# Altium schematic sheet Trafo.SchDoc: Sheetname
size A4; Date: 05.10.2017; CheckedBy: UNCHECKED; Author: Team Member; Organization: Baltic Racing; Address1: Zur Schwedenschanze 15; Address2: Haus 18; Address3: 18435 Stralsund; Revision: xx.xx; SheetNumber: 7; SheetTotal: 8; Rules: TODO; ProjectName: Projekt
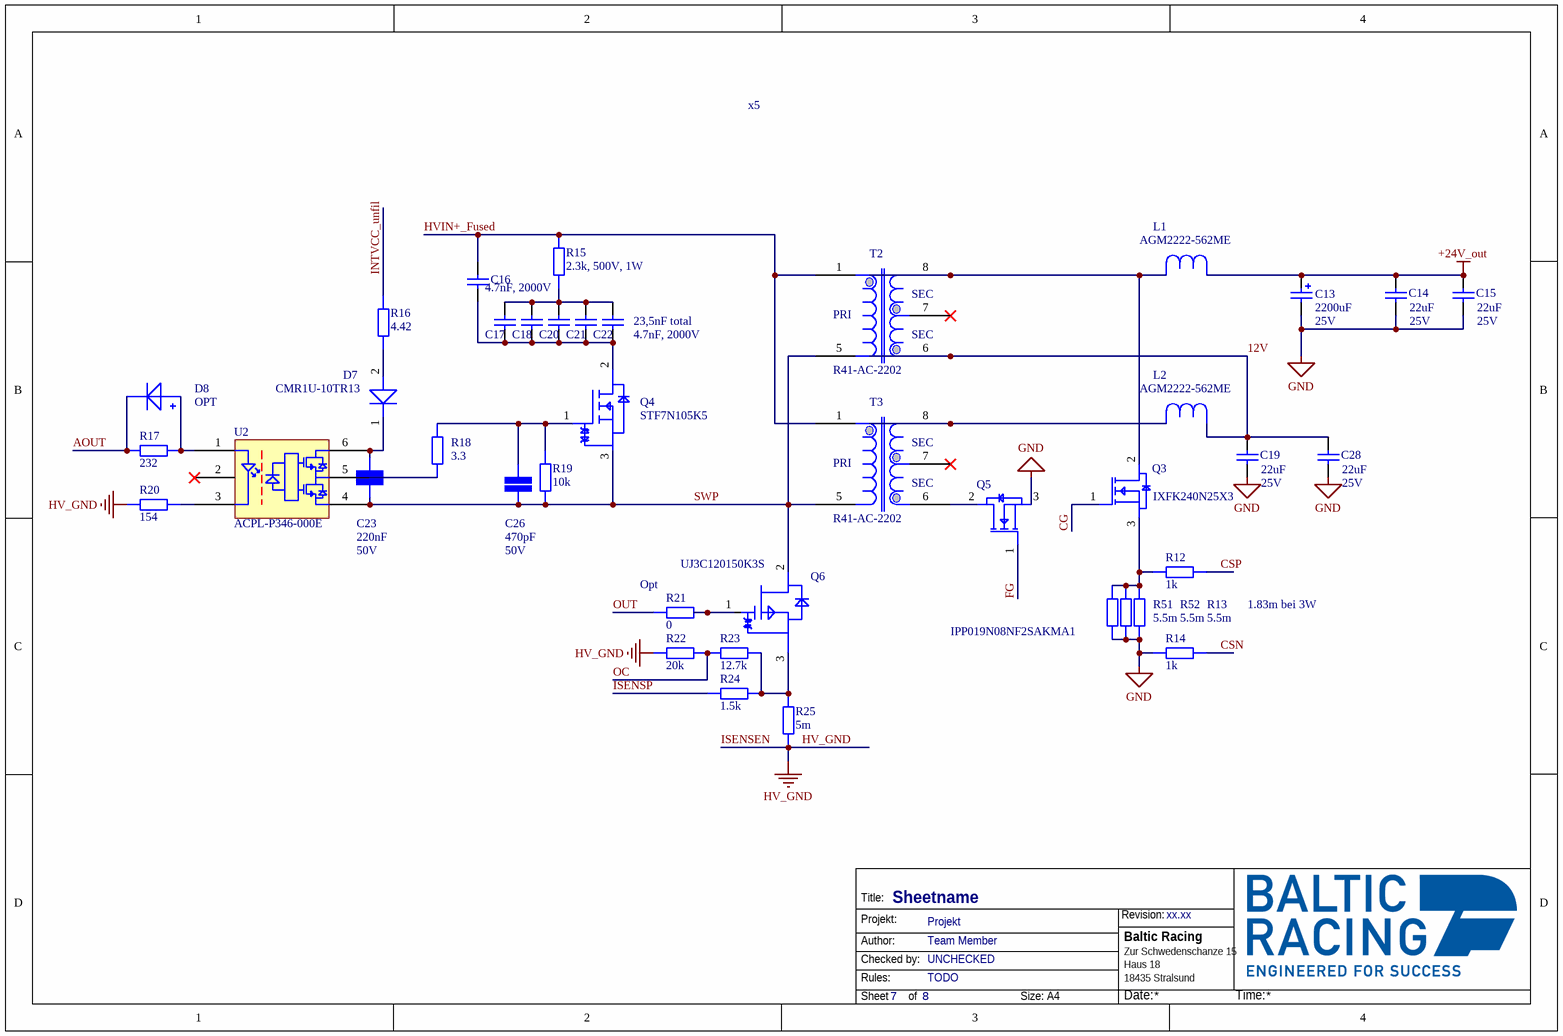
[diagram p0: Trafo.SchDoc]

## Parts
C13  Capacitance: 2200uF  Voltage: 25V  [WCAP-ATG8_D13H25]
C14  Capacitance: 22uF  Voltage: 25V  [WCAP-CSGP_1210_H=2.5mm]
C15  Capacitance: 22uF  Voltage: 25V  [WCAP-CSGP_1210_H=2.5mm]
C16  4.7nF, 2000V  [WCAP-CSMH_1812_H2]
C17  4.7nF, 2000V  [WCAP-CSMH_1812_H2]  (value not drawn)
C18  4.7nF, 2000V  [WCAP-CSMH_1812_H2]  (value not drawn)
C19  Capacitance: 22uF  Voltage: 25V  [WCAP-CSGP_1210_H=2.5mm]
C20  4.7nF, 2000V  [WCAP-CSMH_1812_H2]  (value not drawn)
C21  4.7nF, 2000V  [WCAP-CSMH_1812_H2]  (value not drawn)
C22  4.7nF, 2000V  [WCAP-CSMH_1812_H2]
C23  value 220nF  Voltage: 50V  [CAP 1206/3216]  (hidden comment: SMD Capacitor)
C26  value 470pF  Voltage: 50V  [CAP 1206/3216]  (hidden comment: SMD Capacitor)
C28  Capacitance: 22uF  Voltage: 25V  [WCAP-CSGP_1210_H=2.5mm]
D7  CMR1U-10TR13  [DIOC4536X24L CMR1U-10]
D8  OPT  [DIOM2715X18N]
L1  AGM2222-562ME  [AGM2222-562]
L2  AGM2222-562ME  [AGM2222-562]
Q3  IXFK240N25X3  [IXFK240N25X3_w_Cooler]
Q4  STF7N105K5  [TO-220-3]
Q5  IPP019N08NF2SAKMA1  [IPP019N08NF2SAKMA1_w_Cooler]
Q6  UJ3C120150K3S  [UJ3C120150K3S_w_Cooler]
R12  value 1k  [STACKPOLE CSR1206]  (hidden comment: SMD Resistor)
R13  value 5.5m  [STACKPOLE CSR1206]
R14  value 1k  [STACKPOLE CSR1206]  (hidden comment: SMD Resistor)
R15  value 2.3k, 500V, 1W  [STACKPOLE CSRN2512]  (hidden comment: CRCW25122K20FKEG)
R16  value 4.42  [STACKPOLE CSR0603]  (hidden comment: SMD Resistor)
R17  value 232  [STACKPOLE CSR1206]  (hidden comment: SMD Resistor)
R18  value 3.3  [STACKPOLE CSR0603]  (hidden comment: SMD Resistor)
R19  value 10k  [STACKPOLE CSR0603]  (hidden comment: SMD Resistor)
R20  value 154  [STACKPOLE CSR1206]  (hidden comment: SMD Resistor)
R21  value 0  [STACKPOLE CSR0603]  (hidden comment: SMD Resistor)
R22  value 20k  [STACKPOLE CSR0603]  (hidden comment: SMD Resistor)
R23  value 12.7k  [STACKPOLE CSR0603]  (hidden comment: SMD Resistor)
R24  value 1.5k  [STACKPOLE CSR0603]  (hidden comment: SMD Resistor)
R25  value 5m  [STACKPOLE CSR1206]  (hidden comment: ULR1S-R0055FT2)
R51  value 5.5m  [STACKPOLE CSR1206]
R52  value 5.5m  [STACKPOLE CSR1206]
T2  R41-AC-2202  [R41-AC-2202 Landing Pattern]
T3  R41-AC-2202  [R41-AC-2202 Landing Pattern]
U2  ACPL-P346-000E  [SOP-6 Stretched]

## Nets
+24V_out: C13.1(P) C14.1 C15.1 L1.2
GND: C13.2(N) C14.2 C15.2 C19.2 C28.2 Q5.3 R13.1 R14.1 R51.1 R52.1
HV_GND: R20.1 R22.1 R25.2  [also labelled ISENSEN]
12V: C19.1 C28.1 L2.2 T2.6
AOUT: D8.2 R17.1
CG: Q3.1
CSN: R14.2
CSP: R12.2
FG: Q5.1
HVIN+_Fused: C16.1 R15.2 T2.1 T3.1
INTVCC_unfil: R16.2
ISENSP: R24.1
OC: R22.2 R23.1
OUT: R21.1
SWP: C23.2 C26.2 Q4.3 Q6.2 R19.1 T2.5 T3.5 U2.4
NetC16_2: C16.2 C17.2 C18.2 C20.2 C21.2 C22.2 Q4.2
NetC17_1: C17.1 C18.1 C20.1 C21.1 C22.1 R15.1
NetC23_1: C23.1 D7.1 U2.6
NetC26_1: C26.1 Q4.1 R18.2 R19.2
NetD7_2: D7.2 R16.1
NetD8_1: D8.1 R17.2 U2.1
NetL1_1: L1.1 Q3.2 T2.8
NetL2_1: L2.1 T3.8
NetQ3_3: Q3.3 R12.1 R13.2 R51.2 R52.2
NetQ5_2: Q5.2 T3.6
NetQ6_1: Q6.1 R21.2
NetQ6_3: Q6.3 R23.2 R24.2 R25.1
NetR18_1: R18.1 U2.5
NetR20_2: R20.2 U2.3

Not connected (* = marked no-connect by the designer): T2 7*; T3 7*; U2 2*

## Notes on the sheet
- x5
- (near C22) 23,5nF total
- (near R21) Opt
- 1.83m bei 3W
- Title:
- Projekt:
- Revision:
- Author:
- Rules:
- Checked by:
- Sheet
- of
- Size:
- A4
- Date:
- Time:
- (in symbol R41-AC-2202) SEC; PRI

## Library data of the parts
C13 = 860010478021: WCAP-ATG8 Aluminum Electrolytic Capacitor, Radial, THT, D13xH25, 2200uF, 25V; Manufacturer: Wurth Elektronik; Ripple Current: 1705mA; Rated Voltage: 25VDC; Technical Reference: ATBI250222M025DSPACB000; Leakage Current: 550uA; Endurance: 2000h; Dissipation Factor: 14%; Capacitance Tolerance: +/-20%; ComponentLink2Description: Datasheet; Published Date: October 2020; Packaging: Ammo Pack; Operating Temperature: -40 to +85degC; Mounting Technology: THT; Manufacturer Part Number: 860010478021; Height: 25mm; Diameter: 13mm; ComponentLink2URL: https://www.we-online.com/catalog/datasheet/860010478021.pdf; ComponentLink1URL: http://www.we-online.de; ComponentLink1Description: Manufacturer
C14 C15 C19 C28 = 885012109014: WCAP-CSGP Multilayer Ceramic Chip Capacitor, General Purpose, size 1210, X5R, 22uF, 25V; Manufacturer: Wurth Elektronik; Rated Voltage: 25VDC; Isolation Resistance  min.: 0.005GOhm; Capacitance Tolerance: +/-20%; Dissipation Factor max.: 5%; Technical Reference: X5R1210226M025DFCT10000; ComponentLink1Description: Manufacturer; ComponentLink1URL: http://www.we-online.de; ComponentLink2Description: Datasheet; ComponentLink2URL: https://www.we-online.com/catalog/datasheet/885012109014.pdf; Operating Temperature: -55 to +85degC; Packaging: Tape and Reel; Manufacturer Part Number: 885012109014; Published Date: April 2021; Ceramic Type: X5R; Height: 2.5mm; Mounting Technology: SMT; Size: 1210; Q-Factor min.: -
C16-C18 C20-C22 = 885342211008: WCAP-CSMH Multilayer Ceramic Chip Capacitor, size 1812, X7R Class II, 4.7nF, 2000V; Manufacturer: Wurth Elektronik; Rated Voltage: 2000VDC; Insulation Resistance: 10GOhm; Dissipation Factor: 2.5%; Capacitance Tolerance: +/-10%; Technical Reference: X7R1812472KB00DFCT10000; ComponentLink1Description: Manufacturer; ComponentLink1URL: http://www.we-online.de; ComponentLink2Description: Datasheet; ComponentLink2URL: https://www.we-online.com/catalog/datasheet/885342211008.pdf; Manufacturer Part Number: 885342211008; Mounting Technology: SMT; Operating Temperature: -55 to +125degC; Published Date: May 2020; Packaging: Tape and Reel; Ceramic Type: X7R Class II; Capacitance: 4.7nF; Height: 2mm; Size: 1812
  C16 C17: Voltage: 2000V
C23 C26 = SMD Capacitor: Capacitor with multiple Footprints
D7 = CMR1U-10TR13: Silicon Ultra Fast Recovery Rectifier 1000V 30A 2-Pin SMB Surface Mount T/R; Manufacturer: Central Semiconductor; Average Rectified Current: 1A; Reverse Recovery Time: 100ns; Max Reverse Voltage (DC): 1kV; Forward Voltage: 1.7V; Max Reverse Current: 5uA; Supplier 1: Digi-Key; Manufacturer Part Number: CMR1U-10TR13; RoHS: No; Category: Rectifier Diodes; Pricing 1: 1=1,16000, 10=1,03800, 100=0,80960, 500=0,66880, 1000=0,52800 (USD); Mount: Surface Mount; Case/Package: SMB; Packaging: Tape and Reel; Max Repetitive Reverse Voltage (Vrrm): 1kV; RoHS Compliant: No; Lead Free: Lead Free; ComponentLink1URL: http://www.mouser.com/ds/2/68/cmr1u-01-34700.pdf?src-supplier=Mouser; ComponentLink1Description: http://www.mouser.com/ds/2/68/cmr1u-01-34700.pdf?src-supplier=Mouser; ComponentLink2URL: https://www.centralsemi.com/get_document.php?cmp=1&mergetype=pd&mergepath=pd&pdf_id=CMR1U-01.PDF&src-supplier=Digi-Key; ComponentLink2Description: https://www.centralsemi.com/get_document.php?cmp=1&mergetype=pd&mergepath=pd&pdf_id=CMR1U-01.PDF&src-supplier=Digi-Key; ComponentLink3URL: http://www.centralsemi.com/pdf/CMR1U-01.PDF?src-supplier=Future+Electronics; ComponentLink3Description: http://www.centralsemi.com/pdf/CMR1U-01.PDF?src-supplier=Future+Electronics; ComponentLink4URL: https://my.centralsemi.com/get_document.php?cmp=1&amp;mergetype=pd&amp;mergepath=pd&amp;pdf_id=CMR1U-01.PDF&src-supplier=Digi-Key; ComponentLink4Description: https://my.centralsemi.com/get_document.php?cmp=1&amp;mergetype=pd&amp;mergepath=pd&amp;pdf_id=CMR1U-01.PDF&src-supplier=Digi-Key
D8 = BAT46WH: Supplier 1: Mouser
L1 L2 = AGM2222-562ME: Shielded Power Inductors; ComponentLink1Description: Coilcraft; ComponentLink1URL: https://www.coilcraft.com/en-us/products/power/shielded-inductors/high-current-flat-wire/agp-ver/agm2222/?skuId=30439; ComponentLink2Description: Datasheet; ComponentLink2URL: https://www.coilcraft.com/getmedia/d4f4984d-2507-4e11-ae3d-89829a15fb28/agm2222.pdf
Q3 = IXFK240N25X3: Mosfet N-ch 250V 240A TO264; Manufacturer: IXYS; Supplier 1: Mouser; Manufacturer Part Number: IXFK240N25X3; RoHS: No; Stock 1: 7; Pricing 1: 1=30,00000, 10=27,67000, 50=25,40000, 100=24,04000, 1000=24,04000, 10000=24,04000 (USD)
Q4 = STF7N105K5: N-channel 1050 V, 1.4 Ohm typ., 4 A MDmesh K5 Power MOSFETs in TO-220FP package; Manufacturer: STMicroelectronics; Drain to Source Voltage (Vdss): 1.05kV; Continuous Drain Current (ID): 4A; Rds On Max: 2R; Input Capacitance: 380pF; Max Power Dissipation: 25W; Supplier 1: Newark; Manufacturer Part Number: STF7N105K5; RoHS: Yes; Category: MOSFETs; Stock 1: 996; Pricing 1: 1=3,16000, 10=2,71000, 100=2,16000, 500=1,87000, 1000=1,61000 (USD); Mount: Through Hole; Case/Package: TO-220-3; Min Operating Temperature: -55°C; Max Operating Temperature: 150°C; Packaging: Rail/Tube; Lead Free: Lead Free; RoHS Compliant: Yes; ComponentLink1URL: http://www.mouser.com/ds/2/389/stf7n105k5-955843.pdf?src-supplier=Mouser; ComponentLink1Description: http://www.mouser.com/ds/2/389/stf7n105k5-955843.pdf?src-supplier=Mouser; ComponentLink2URL: http://www.st.com/content/ccc/resource/technical/document/datasheet/26/20/d1/f7/b4/c1/4c/55/DM00112886.pdf/files/DM00112886.pdf/jcr:content/translations/en.DM00112886.pdf?src-supplier=Digi-Key; ComponentLink2Description: http://www.st.com/content/ccc/resource/technical/document/datasheet/26/20/d1/f7/b4/c1/4c/55/DM00112886.pdf/files/DM00112886.pdf/jcr:content/translations/en.DM00112886.pdf?src-supplier=Digi-Key; ComponentLink3URL: http://www.st.com/st-web-ui/static/active/en/resource/technical/document/datasheet/DM00112886.pdf?src-supplier=Avnet; ComponentLink3Description: http://www.st.com/st-web-ui/static/active/en/resource/technical/document/datasheet/DM00112886.pdf?src-supplier=Avnet; ComponentLink4URL: http://www.farnell.com/datasheets/2371890.pdf?src-supplier=Newark; ComponentLink4Description: http://www.farnell.com/datasheets/2371890.pdf?src-supplier=Newark
Q5 = IPP019N08NF2SAKMA1: Transistor Power MOSFET N-Channel 80V 191A 3-Pin TO-220 Tube; Manufacturer: Infineon; Supplier 1: Digi-Key; Manufacturer Part Number: IPP019N08NF2SAKMA1; RoHS: No; Category: Uncategorized; Stock 1: 760; Pricing 1: 1=3,34000, 10=2,99500, 100=2,45420, 500=2,09760 (USD)
Q6 = UJ3C120150K3S: Sicfet N-ch 1200V 18.4A TO247-3; Manufacturer: UnitedSiC; Supplier 1: Mouser; Manufacturer Part Number: UJ3C120150K3S; RoHS: No; Stock 1: 697; Pricing 1: 1=9,16000, 10=8,28000, 50=7,90000, 100=7,90000, 1000=5,96000, 10000=5,15000 (USD)
R12-R25 R51 R52 = SMD Resistor: Resistor with multiple footprints
T2 T3 = R41-AC-2202: High Voltage Transformer
U2 = ACPL-P346-000E: Logic IC Output Optocoupler, 1-Element, 3750V Isolation; Manufacturer: Broadcom Avago; Propagation Delay: 120ns; Number of Channels: 1; Forward Voltage: 1.55V; Max Output Current: 2.5A; Pulse Width Distortion (PWD): 50ns; High Level Output Current: 2A; Operating Supply Voltage: 20V; Forward Current: 4mA; Max Power Dissipation: 550mW; Rise Time: 8ns; Isolation Voltage: 3.75kV; Output Current: 1A; Input Current: 11mA; Max Input Current: 25mA; Approvals: CSA,UR,UL,IEC; Supplier 1: Digi-Key; Manufacturer Part Number: ACPL-P346-000E; RoHS: Yes; Category: Optocouplers; Stock 1: 1063; Pricing 1: 1=5,00000, 10=3,53300, 100=2,89340, 500=2,43922, 1000=2,38050 (USD); Mount: Surface Mount; Case/Package: SOIC; Number of Pins: 6; Min Operating Temperature: -40°C; Max Operating Temperature: 105°C; Packaging: Rail/Tube; Package Quantity: 100; Turn-On Delay Time: 120ns; Low Level Output Current: 2A; Fall Time: 8ns; Output Voltage: 20V; Radiation Hardening: No; RoHS Compliant: Yes; REACH SVHC: No SVHC